# EAGLE design HAP-6xRelais-3.1 (EAGLE 5.02)
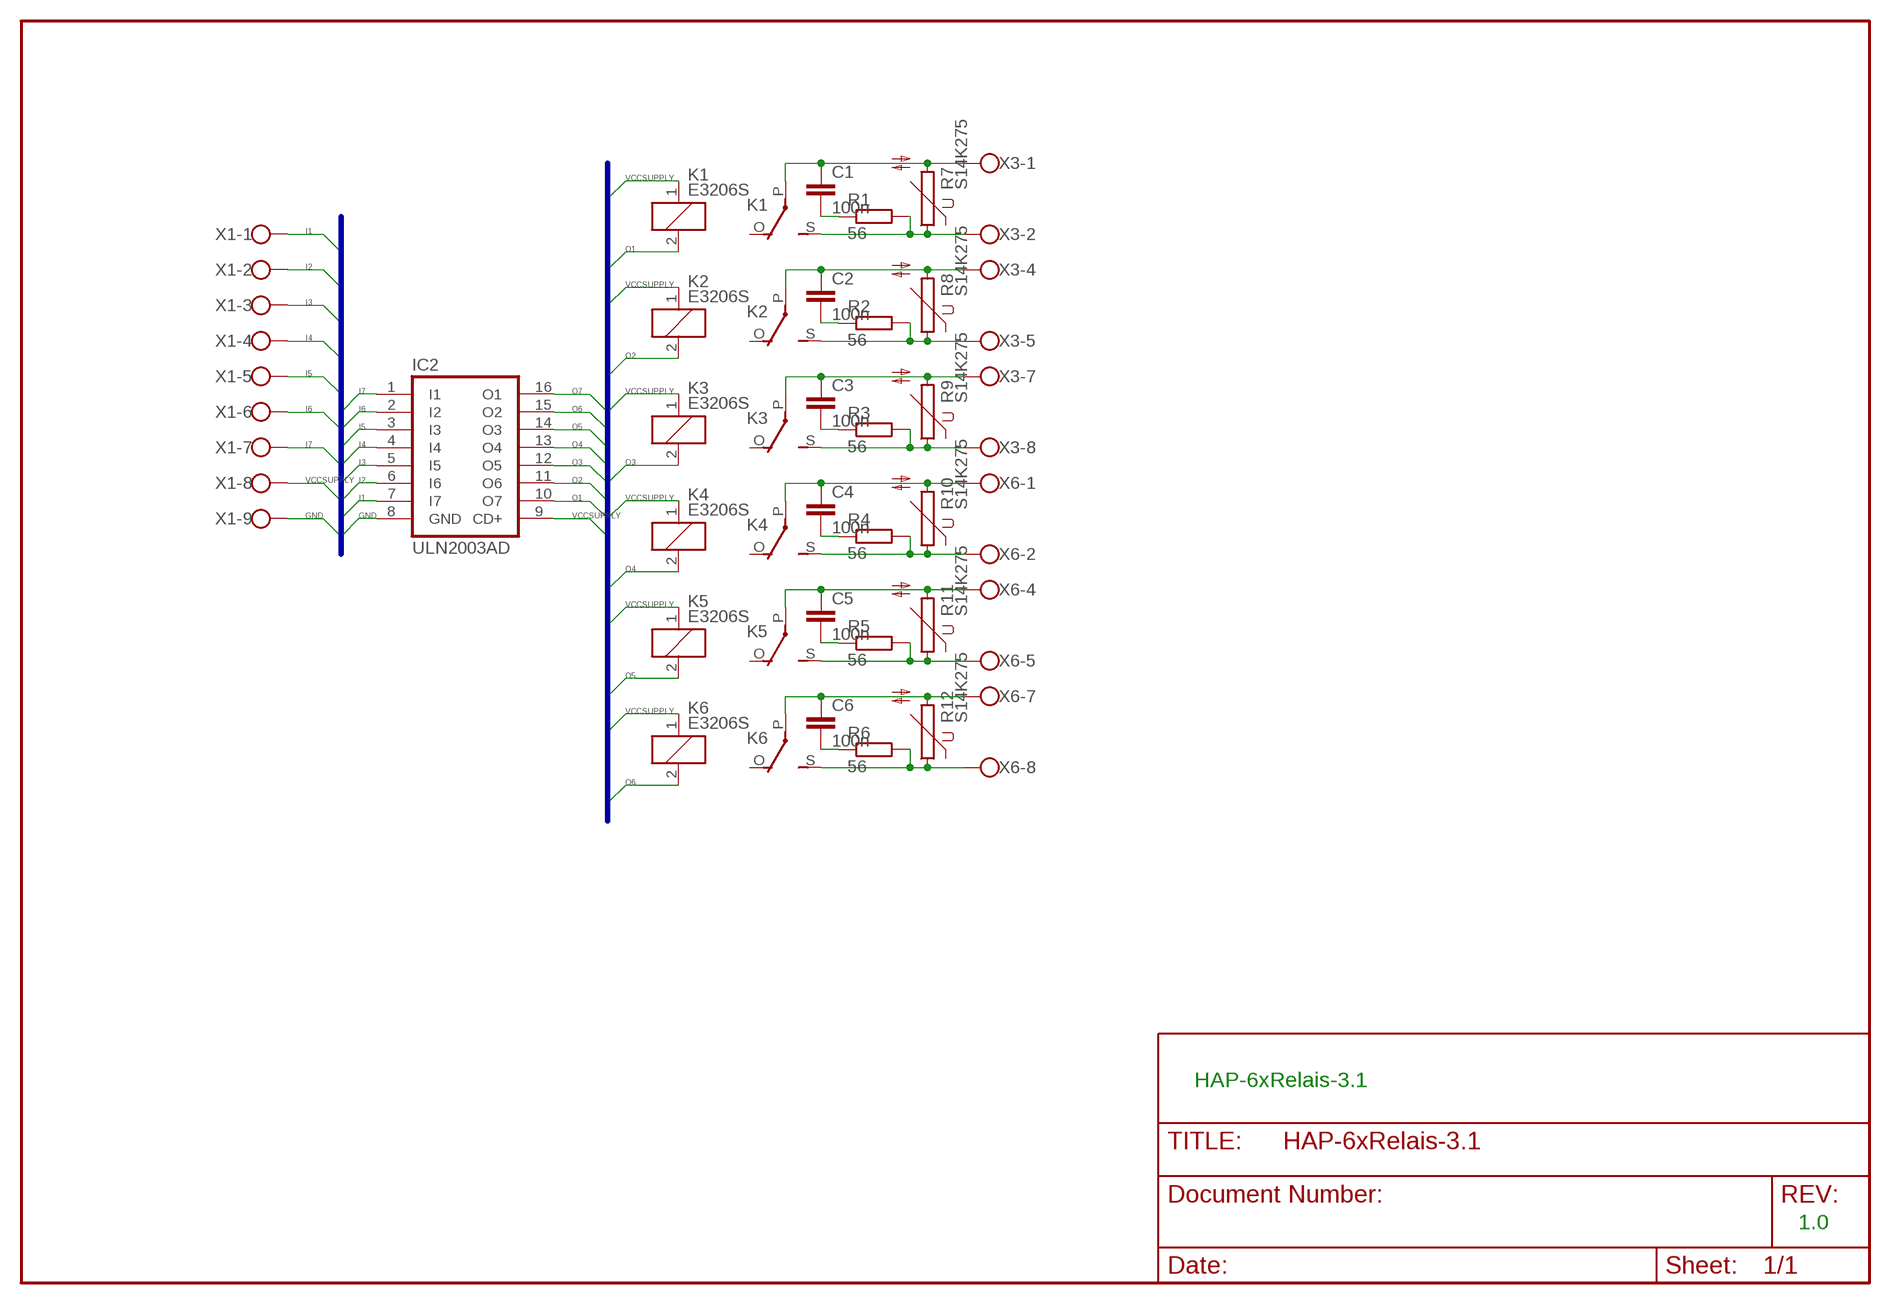
[diagram p0: schematic, sheet 1]

## Parts
C1  100n  C15/8  [C15B8]
C2  100n  C15/8  [C15B8]
C3  100n  C15/8  [C15B8]
C4  100n  C15/8  [C15B8]
C5  100n  C15/8  [C15B8]
C6  100n  C15/8  [C15B8]
IC2  ULN2003AD  [SO16]
K1  E3206S  [E3206S]
K2  E3206S  [E3206S]
K3  E3206S  [E3206S]
K4  E3206S  [E3206S]
K5  E3206S  [E3206S]
K6  E3206S  [E3206S]
R1  56  R-EU_0207/5V  [0207/5V]
R2  56  R-EU_0207/5V  [0207/5V]
R3  56  R-EU_0207/5V  [0207/5V]
R4  56  R-EU_0207/5V  [0207/5V]
R5  56  R-EU_0207/5V  [0207/5V]
R6  56  R-EU_0207/5V  [0207/5V]
R7  S14K275  [S14K275]
R8  S14K275  [S14K275]
R9  S14K275  [S14K275]
R10  S14K275  [S14K275]
R11  S14K275  [S14K275]
R12  S14K275  [S14K275]
X1  W237-09P  [W237-9P]
X3  W237-08P  [W237-8P]
X6  W237-08P  [W237-8P]

## Nets
GND [Medium]: IC2.8(GND) X1.9
I1: IC2.7(I7) X1.1
I2: IC2.6(I6) X1.2
I3: IC2.5(I5) X1.3
I4: IC2.4(I4) X1.4
I5: IC2.3(I3) X1.5
I6: IC2.2(I2) X1.6
I7: IC2.1(I1) X1.7
N$1 [Medium]: C2.2 R2.1
N$2 [Mains]: K1.S(2:S) R1.2 R7.1 X3.2
N$3 [Mains]: C2.1 K2.P(2:P) R8.2 X3.4
N$4 [Mains]: K3.S(2:S) R3.2 R9.1 X3.8
N$5 [Mains]: K2.S(2:S) R2.2 R8.1 X3.5
N$6 [Mains]: K4.S(2:S) R4.2 R10.1 X6.2
N$7 [Mains]: C4.1 K4.P(2:P) R10.2 X6.1
N$8 [Mains]: C3.1 K3.P(2:P) R9.2 X3.7
N$9 [Mains]: C5.1 K5.P(2:P) R11.2 X6.4
N$10 [Mains]: K5.S(2:S) R5.2 R11.1 X6.5
N$11 [Mains]: C6.1 K6.P(2:P) R12.2 X6.7
N$12 [Mains]: K6.S(2:S) R6.2 R12.1 X6.8
N$13 [Mains]: C1.1 K1.P(2:P) R7.2 X3.1
N$14 [Medium]: C1.2 R1.1
N$15 [Medium]: C3.2 R3.1
N$16 [Medium]: C6.2 R6.1
N$18 [Medium]: C5.2 R5.1
N$19 [Medium]: C4.2 R4.1
O1: IC2.10(O7) K1.2
O2: IC2.11(O6) K2.2
O3: IC2.12(O5) K3.2
O4: IC2.13(O4) K4.2
O5: IC2.14(O3) K5.2
O6: IC2.15(O2) K6.2
O7: IC2.16(O1)
VCCSUPPLY [Medium]: IC2.9(CD+) K1.1 K2.1 K3.1 K4.1 K5.1 K6.1 X1.8
Unconnected: K1.O(2:O) K2.O(2:O) K3.O(2:O) K4.O(2:O) K5.O(2:O) K6.O(2:O) X3.3 X3.6 X6.3 X6.6

## Buses
VCCSUPPLY,GND,O1,O2,O3,O4,O5,O6,O7,O8,I1,I2,I3,I4,I5,I6,I7,I8

## Notes on the sheet
- HAP-6xRelais-3.1
- 1.0

## Library data of the parts
C1-C6 = capacitor-wima:C: CAPACITOR naming: grid - package width
IC2 = uln-udn:ULN2003A: DRIVER ARRAY
K1-K6 = relay:E3206S: RELAY 1 x switch, Eichhoff/distributor Schukat
R1-R6 = resistor:R-EU_: RESISTOR, European symbol
R7-R12 = varistor:S14K275: VARISTOR
X1 = con-wago-508:W237-09P: WAGO SREW CLAMP
X3 X6 = con-wago-508:W237-08P: WAGO SREW CLAMP

## Net classes
1 Mains: width 3.251 mm, clearance 0.762 mm
2 Medium: width 1.016 mm, clearance 0.254 mm

## Board
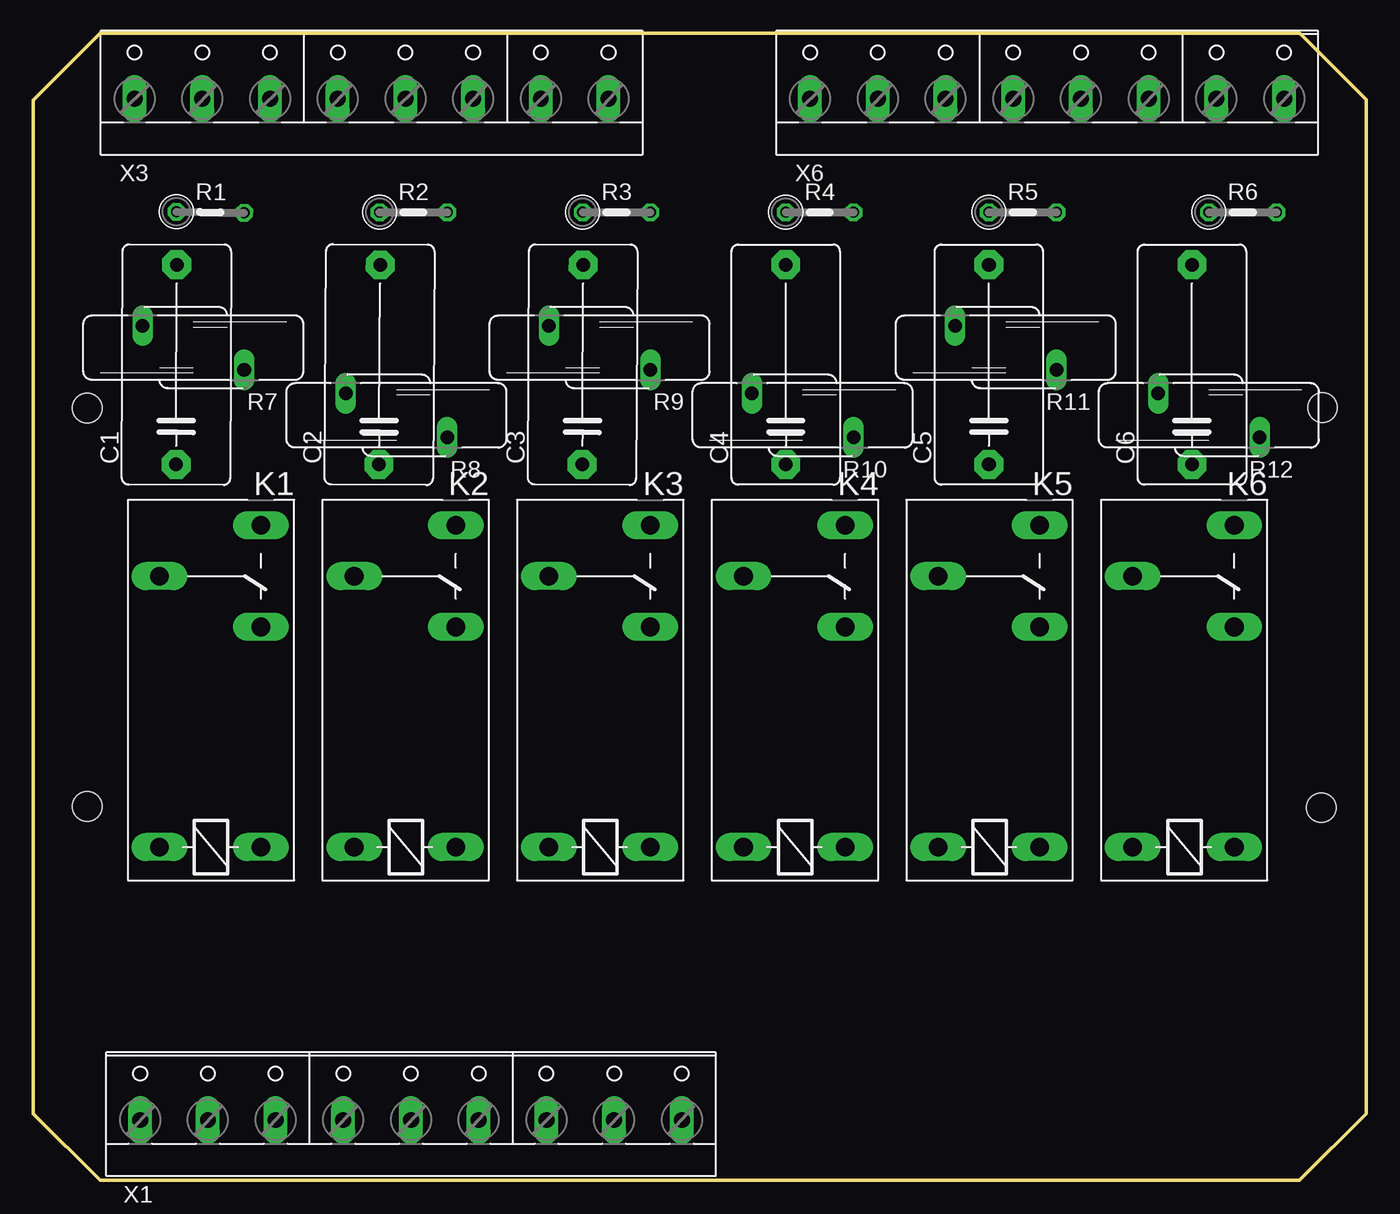
[diagram p1: board, top side]
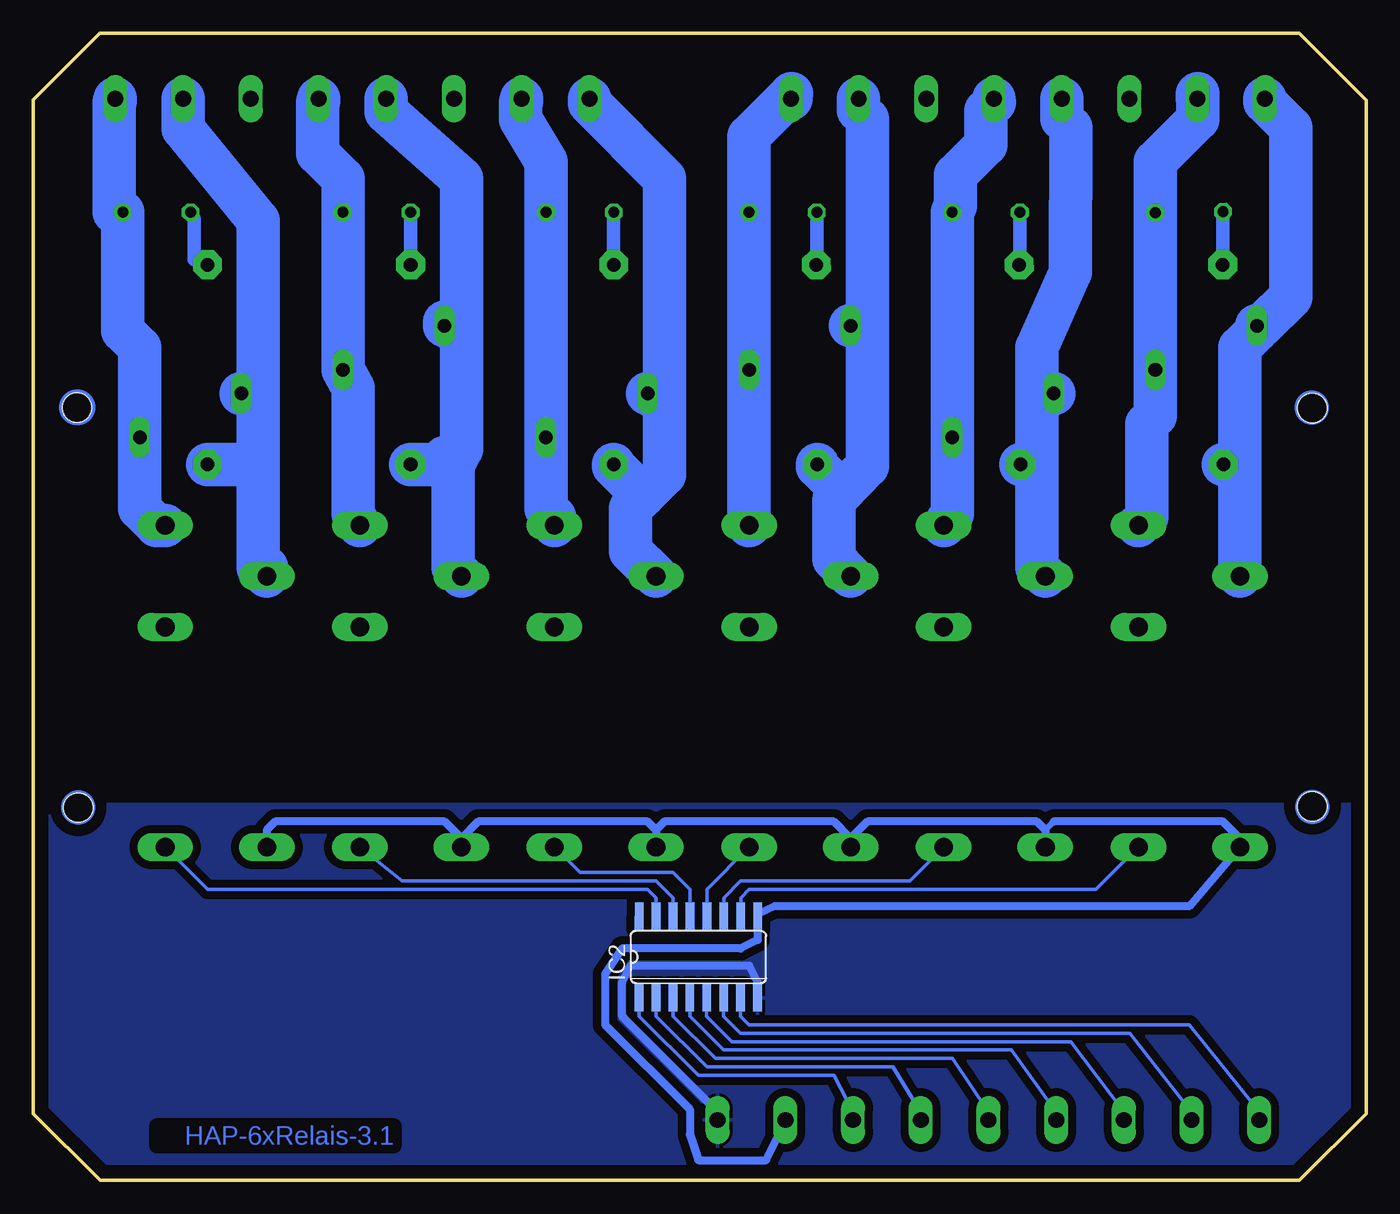
[diagram p2: board, bottom side, seen from below]

Size 100.01 x 86.08 mm. Coordinates in mm from the lower left corner, seen from the top.
Outline: 100.01,5.01 100.01,81.08 95.01,86.08 5.01,86.08 0,81.07 0.01,5 5.01,0 95,0 100,5
Copper layers (1*16): Top 0.035mm / dielectric 1.5mm / Bottom 0.035mm
Design rules "default": minimum track width 10mil, minimum drill 24mil, track to track 8mil, track to pad 12mil, pad to pad 8mil, via to via 8mil, smd to smd 8mil, copper to edge 40mil, drill to drill 8mil, minimum pad ring 10mil, minimum via ring 8mil, stop-mask expansion 4mil, vias tented up to drill 0mil, thermal gap 10mil
Holes 2.2 mm at 4.04,28.07 96.64,27.97 4.04,57.96 96.74,58

### Footprints (pad centres in the part's own frame; a part is rotated, then mirrored left to right if it is on the bottom)
C15B8 = drill 1.016 pad 2.159 octagon: 1 -7.493,0; 2 7.493,0
SO16 = smd 0.66 x 2.032: 1 -4.445,-3.073; 2 -3.175,-3.073; 3 -1.905,-3.073; 4 -0.635,-3.073; 5 0.635,-3.073; 6 1.905,-3.073; 7 3.175,-3.073; 8 4.445,-3.073; 9 4.445,3.073; 10 3.175,3.073; 11 1.905,3.073; 12 0.635,3.073; 13 -0.635,3.073; 14 -1.905,3.073; 15 -3.175,3.073; 16 -4.445,3.073
E3206S = drill 1.397 long: 1 -3.175,3.81; 2 -3.175,-3.81; O 13.335,-3.81; P 17.145,3.81; S 20.955,-3.81
0207/5V = drill 0.813 octagon: 1 -2.54,0; 2 2.54,0
S14K275 = drill 1.016 long: 1 -1.651,-3.81; 2 1.651,3.81
W237-9P = drill 1.194 long: 1 -20.32,-0.635; 2 -15.24,-0.635; 3 -10.16,-0.635; 4 -5.08,-0.635; 5 0,-0.635; 6 5.08,-0.635; 7 10.16,-0.635; 8 15.24,-0.635; 9 20.32,-0.635
W237-8P = drill 1.194 long: 1 -17.78,-0.635; 2 -12.7,-0.635; 3 -7.62,-0.635; 4 -2.54,-0.635; 5 2.54,-0.635; 6 7.62,-0.635; 7 12.7,-0.635; 8 17.78,-0.635

### Placement (x,y rotation side)
C1  10.74,61.22 89.8 top
C2  25.98,61.22 89.6 top
C3  41.22,61.22 89.7 top
C4  56.46,61.22 90 top
C5  71.7,61.22 90 top
C6  86.94,61.22 90 top
IC2  50.11,16.77 359.9 bottom
K1  13.28,28.2 90 top
K2  27.88,28.2 90 top
K3  42.49,28.2 90 top
K4  57.09,28.2 90 top
K5  71.7,28.2 90 top
K6  86.31,28.2 90 top
R1  13.28,72.65 359.1 top
R2  28.52,72.65 0 top
R3  43.76,72.65 0 top
R4  59,72.65 0 top
R5  74.24,72.65 0 top
R6  90.75,72.65 0 top
R7  12.01,62.49 90 top
R8  27.25,57.41 90 top
R9  42.49,62.49 90 top
R10  57.73,57.41 90 top
R11  72.97,62.49 90 top
R12  88.21,57.41 90 top
X1  28.34,5.17 0 top
X3  25.38,81.81 0 top
X6  76.07,81.81 0 top

### Tracks (layer width: path | path; a pad name or v marks a point on that pad's centre or on a via)
GND
  Bottom 0.406: X1.9 48.67,5.17
  Bottom 0.61: IC2.8 45.67,14.87 46.3,16.13 55.19,16.13 55.82,14.87 55.82,12.33 48.67,5.17
  pour Bottom (isolate 0.61): 0.58,28.2 99.64,28.2 100.28,27.57 100.28,4.71 95.2,-0.38 5.03,-0.38 -0.05,4.71 -0.05,28.2
I1
  Bottom 0.254: IC2.7 46.94,12.33 46.3,11.69 13.28,11.69 8.03,5.17 X1.1
I2
  Bottom 0.254: IC2.6 48.21,12.33 46.94,11.05 17.72,11.05 13.11,5.17 X1.2
I3
  Bottom 0.254: IC2.5 49.48,12.33 47.57,10.42 22.17,10.42 18.19,5.17 X1.3
I4
  Bottom 0.254: IC2.4 50.75,12.33 48.2,9.79 26.61,9.79 23.27,5.17 X1.4
I5
  Bottom 0.254: IC2.3 52.02,12.33 48.84,9.15 31.06,9.15 28.35,5.17 X1.5
I6
  Bottom 0.254: IC2.2 53.29,12.33 49.48,8.52 35.51,8.52 33.43,5.17 X1.6
I7
  Bottom 0.254: IC2.1 54.56,12.33 50.11,7.88 39.95,7.88 38.51,5.17 X1.7
N$1
  Bottom 1.016: R2.1 25.98,69.6 C2.2
N$2
  Bottom 3.251: 15.82,60.59 R7.1 15.82,57.41 16.45,56.77 16.45,49.79 K1.S | 15.82,60.59 R1.2 15.82,76.46 12.64,79.63 12.64,81.54 12.68,81.5 X3.2 | 15.82,60.59
N$3
  Bottom 3.251: X3.4 22.84,79.67 22.17,79 22.2,68.17 24.71,62.49 24.71,58.05 | 24.71,53.6 24.71,45.98 K2.P | 24.71,53.6 24.71,58.05 | R8.2 23.69,59.06 24.71,58.05 | C2.1 24.84,53.73 24.71,53.6
N$4
  Bottom 3.251: K3.S R9.1 R3.2 46.3,78.37 43.16,81.5 | 43.16,81.5 43.12,81.54 | 43.16,81.5 X3.8
N$5
  Bottom 3.251: K2.S 31.06,50.04 R8.1 R2.2 30.81,73.16 30.81,75.44 28.52,77.73 28.52,80.27 27.88,80.91 27.92,80.94 X3.5
N$6
  Bottom 3.251: K4.S 60.91,49.79 61.54,50.42 R10.1 R4.2 61.54,76.46 63.45,79.63 63.45,80.91 63.37,80.98 X6.2
N$7
  Bottom 3.251: X6.1 58.29,80.83 52.65,75.19 52.65,59.31 | 52.65,59.31 52.65,52.97 54.24,51.38 | 54.24,51.38 55.19,50.42 55.19,47.25 K4.P | C4.1 56.46,53.6 54.24,51.38 | R10.2 53.67,59.06 53.28,58.68 52.65,59.31
N$8
  Bottom 3.251: X3.7 38.08,80.31 37.41,79.63 37.41,63.76 | 37.41,63.76 37.41,53.6 38.05,52.97 | 38.05,52.97 39.95,51.06 39.95,46.62 K3.P | C3.1 41.18,53.56 39.95,52.33 38.68,52.33 38.05,52.97 | R9.2 37.79,64.14 37.41,63.76
N$9
  Bottom 3.251: X6.4 73.53,80.19 67.89,75.19 67.89,63.76 | 67.89,54.87 67.89,63.76 | K5.P 68.53,45.98 68.53,53.6 67.89,54.87 | C5.1 69.29,53.73 69.16,53.6 69.16,54.23 67.89,54.87 | R11.2 69.16,64.4 68.53,63.76 67.89,63.76
N$10
  Bottom 3.251: K5.S 76.02,50.04 76.02,59.44 R11.1 R5.2 76.78,75.19 78.69,77.09 78.69,80.91 78.61,80.98 X6.5
N$11
  Bottom 3.251: X6.7 88.77,78.93 83.13,72.01 83.13,58.68 | 83.13,53.6 83.13,45.98 82.5,45.98 K6.P | 83.13,53.6 83.13,58.68 | C6.1 83.89,53.73 83.77,53.6 83.13,53.6 | R12.2 83.51,59.06 83.13,58.68
N$12
  Bottom 3.251: K6.S 90.75,49.16 92.02,50.42 R12.1 | R12.1 92.02,56.14 | R12.1 92.02,62.49 93.29,63.76 93.29,71.38 | 93.29,71.38 93.29,72.01 93.93,72.65 93.93,80.91 93.85,80.98 X6.8 | 93.29,71.38 R6.2
N$13
  Bottom 3.251: 9.47,52.97 9.47,62.49 8.2,63.76 R7.2 7.82,64.14 5.66,66.3 5.66,79 7.6,80.94 X3.1 | K1.P 9.47,52.97 | 9.47,52.97 10.11,53.6 | C1.1 10.23,53.73 9.47,52.97
N$14
  Bottom 1.016: R1.1 10.74,72.14 10.74,69.6 C1.2
N$15
  Bottom 1.016: R3.1 41.22,69.6 C3.2
N$16
  Bottom 1.016: R6.1 87.96,72.14 87.96,69.09 C6.2
N$18
  Bottom 1.016: C5.2 R5.1
N$19
  Bottom 1.016: C4.2 R4.1
O1
  Bottom 0.254: IC2.10 46.93,21.22 46.3,21.85 20.27,21.85 K1.2
O2
  Bottom 0.254: IC2.11 48.2,21.22 46.94,22.48 34.23,22.48 K2.2
O3
  Bottom 0.254: IC2.12 49.47,21.86 K3.2
O4
  Bottom 0.254: IC2.13 50.74,21.84 52.02,23.12 59,23.12 K4.2
O5
  Bottom 0.254: IC2.14 52.01,21.21 53.28,22.48 72.34,22.48 K5.2
O6
  Bottom 0.254: K6.2 86.94,21.85 53.92,21.85 53.28,21.21 53.28,19.95 53.28,19.94 IC2.15
VCCSUPPLY
  Bottom 0.406: 45.66,19.95 IC2.9 | 23.44,26.93 24.07,26.3 | K1.1 9.47,25.66 | 43.76,5.34 43.59,5.17 X1.8
  Bottom 0.61: IC2.9 45.66,18.05 46.94,17.41 55.82,17.41 57.09,15.5 57.09,11.69 50.74,5.34 50.74,3.44 50.11,1.53 45.03,1.53 43.76,4.07 43.76,5.34 | 45.66,19.95 44.39,20.58 13.28,20.58 K1.1 | K2.1 24.07,26.3 24.71,26.93 37.41,26.93 38.68,25.66 | 23.44,26.93 10.74,26.93 9.47,25.66 | 38.68,25.66 K3.1 | 53.28,26.3 K4.1 | 53.28,26.3 52.65,26.93 39.95,26.93 38.68,25.66 | 67.89,25.66 K5.1 | 67.89,25.66 66.62,26.93 53.92,26.93 53.28,26.3 | K6.1 82.5,26.3 81.86,26.93 69.16,26.93 67.89,25.66
(copper drawn outside any net)
  shapes: Bottom circle x4

### Text on the board
Bottom: HAP-6xRelais-3.1